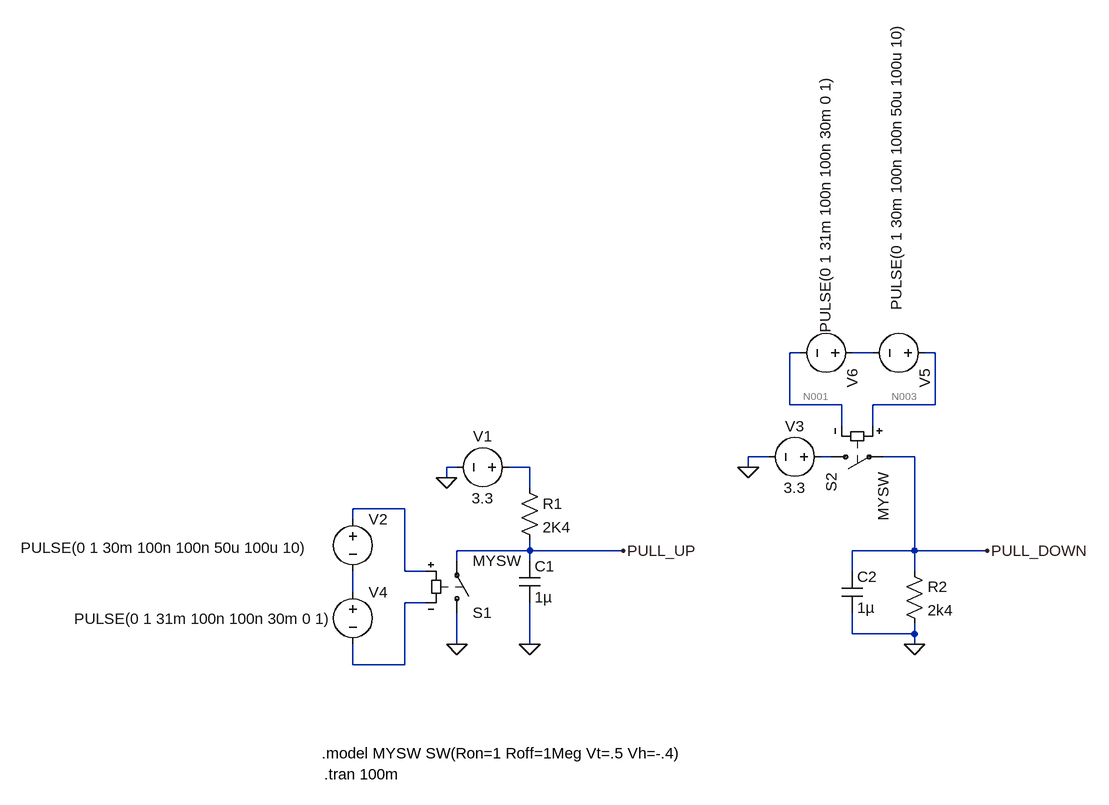
[diagram p0: schematic LTSpice.asc]
LTSpice.asc, the LTspice schematic file:
Version 4
SHEET 1 1000 680
WIRE 544 -96 528 -96
WIRE 656 -96 624 -96
WIRE 752 -96 736 -96
WIRE 528 -16 528 -96
WIRE 608 -16 528 -16
WIRE 752 -16 752 -96
WIRE 752 -16 656 -16
WIRE 608 16 608 -16
WIRE 656 16 656 -16
WIRE 496 64 464 64
WIRE 592 64 576 64
WIRE 720 64 672 64
WIRE 16 80 0 80
WIRE 128 80 96 80
WIRE 464 80 464 64
WIRE 0 96 0 80
WIRE 128 112 128 80
WIRE -64 144 -144 144
WIRE -144 160 -144 144
WIRE 128 208 128 192
WIRE 128 208 16 208
WIRE 272 208 128 208
WIRE 720 208 720 64
WIRE 720 208 624 208
WIRE 832 208 720 208
WIRE 16 224 16 208
WIRE 128 224 128 208
WIRE -64 240 -64 144
WIRE -32 240 -64 240
WIRE 624 240 624 208
WIRE 720 240 720 208
WIRE -144 272 -144 240
WIRE -32 288 -64 288
WIRE 624 336 624 304
WIRE 720 336 720 320
WIRE 720 336 624 336
WIRE 16 352 16 304
WIRE 128 352 128 288
WIRE 720 352 720 336
WIRE -144 384 -144 352
WIRE -64 384 -64 288
WIRE -64 384 -144 384
FLAG 0 96 0
FLAG 128 352 0
FLAG 272 208 PULL_UP
FLAG 16 352 0
FLAG 832 208 PULL_DOWN
FLAG 464 80 0
FLAG 720 352 0
SYMBOL voltage 112 80 R90
WINDOW 0 -32 56 VBottom 2
WINDOW 3 32 56 VTop 2
WINDOW 123 0 0 Left 0
WINDOW 39 0 0 Left 0
SYMATTR InstName V1
SYMATTR Value 3.3
SYMBOL res 112 96 R0
SYMATTR InstName R1
SYMATTR Value 2K4
SYMBOL cap 112 224 R0
SYMATTR InstName C1
SYMATTR Value 1µ
SYMBOL sw 16 320 M180
SYMATTR InstName S1
SYMATTR Value MYSW
SYMBOL voltage -144 144 R0
WINDOW 3 -511 60 Left 2
WINDOW 123 0 0 Left 0
WINDOW 39 0 0 Left 0
SYMATTR InstName V2
SYMATTR Value PULSE(0 1 30m 100n 100n 50u 100u 10)
SYMBOL sw 576 64 M90
SYMATTR InstName S2
SYMATTR Value MYSW
SYMBOL voltage 592 64 R90
WINDOW 0 -32 56 VBottom 2
WINDOW 3 32 56 VTop 2
WINDOW 123 0 0 Left 0
WINDOW 39 0 0 Left 0
SYMATTR InstName V3
SYMATTR Value 3.3
SYMBOL res 704 224 R0
SYMATTR InstName R2
SYMATTR Value 2k4
SYMBOL cap 608 240 R0
SYMATTR InstName C2
SYMATTR Value 1µ
SYMBOL voltage -144 256 R0
WINDOW 3 -429 57 Left 2
WINDOW 123 0 0 Left 0
WINDOW 39 0 0 Left 0
SYMATTR InstName V4
SYMATTR Value PULSE(0 1 31m 100n 100n 30m 0 1)
SYMBOL voltage 752 -96 R90
WINDOW 3 -511 60 Left 2
WINDOW 123 0 0 Left 0
WINDOW 39 0 0 Left 0
SYMATTR InstName V5
SYMATTR Value PULSE(0 1 30m 100n 100n 50u 100u 10)
SYMBOL voltage 640 -96 R90
WINDOW 3 -429 57 Left 2
WINDOW 123 0 0 Left 0
WINDOW 39 0 0 Left 0
SYMATTR InstName V6
SYMATTR Value PULSE(0 1 31m 100n 100n 30m 0 1)
TEXT -188 552 Left 2 !.tran 100m
TEXT -192 520 Left 2 !.model MYSW SW(Ron=1 Roff=1Meg Vt=.5 Vh=-.4)

The netlist it stands for:
* LTSpice.asc
V1 N005 0 3.3
R1 N005 PULL_UP 2K4
C1 PULL_UP 0 1µ
S1 0 PULL_UP N006 N008 MYSW
V2 N006 N007 PULSE(0 1 30m 100n 100n 50u 100u 10)
S2 N004 PULL_DOWN N003 N001 MYSW
V3 N004 0 3.3
R2 PULL_DOWN 0 2k4
C2 PULL_DOWN 0 1µ
V4 N007 N008 PULSE(0 1 31m 100n 100n 30m 0 1)
V5 N003 N002 PULSE(0 1 30m 100n 100n 50u 100u 10)
V6 N002 N001 PULSE(0 1 31m 100n 100n 30m 0 1)
.tran 100m
.model MYSW SW(Ron=1 Roff=1Meg Vt=.5 Vh=-.4)
.backanno
.end

* Results of the author's LTspice run, read from the files saved beside the schematic
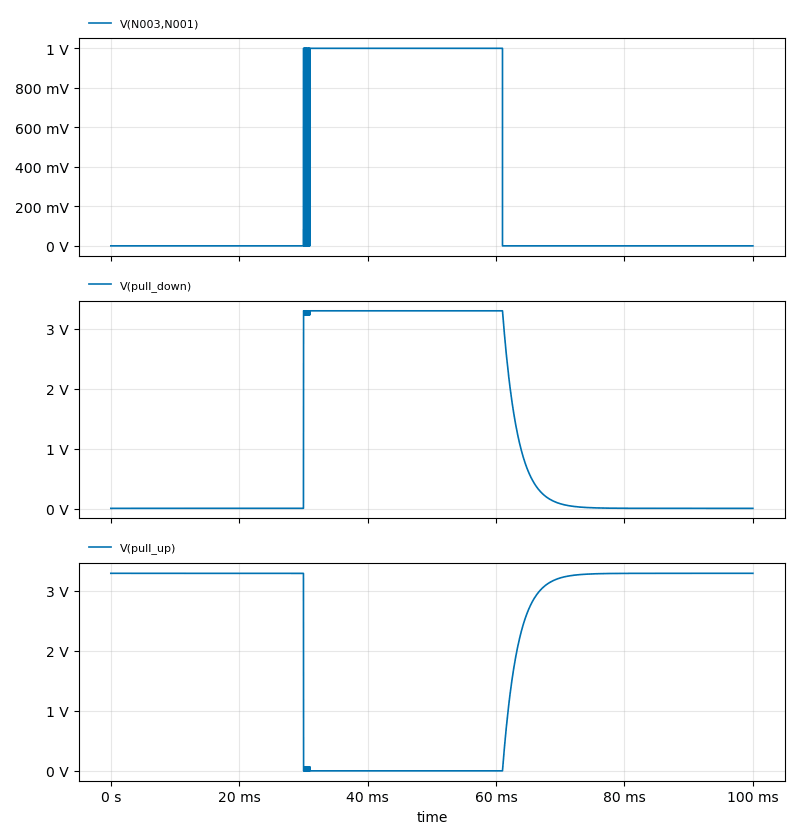
[diagram p1: Transient Analysis of LTSpice.asc, plotted from the saved traces]
* Transient Analysis, 1 run:
*   V(N003,N001): min 0 V, max 1 V, average 305 mV, rms 552.3 mV, last 0 V
*   V(pull_down): min 7.901 mV, max 3.299 V, average 1.107 V, rms 1.872 V, last 7.901 mV
*   V(pull_up): min 1.374 mV, max 3.292 V, average 2.193 V, rms 2.663 V, last 3.292 V